# EAGLE design Schematic (EAGLE 9.4.2)
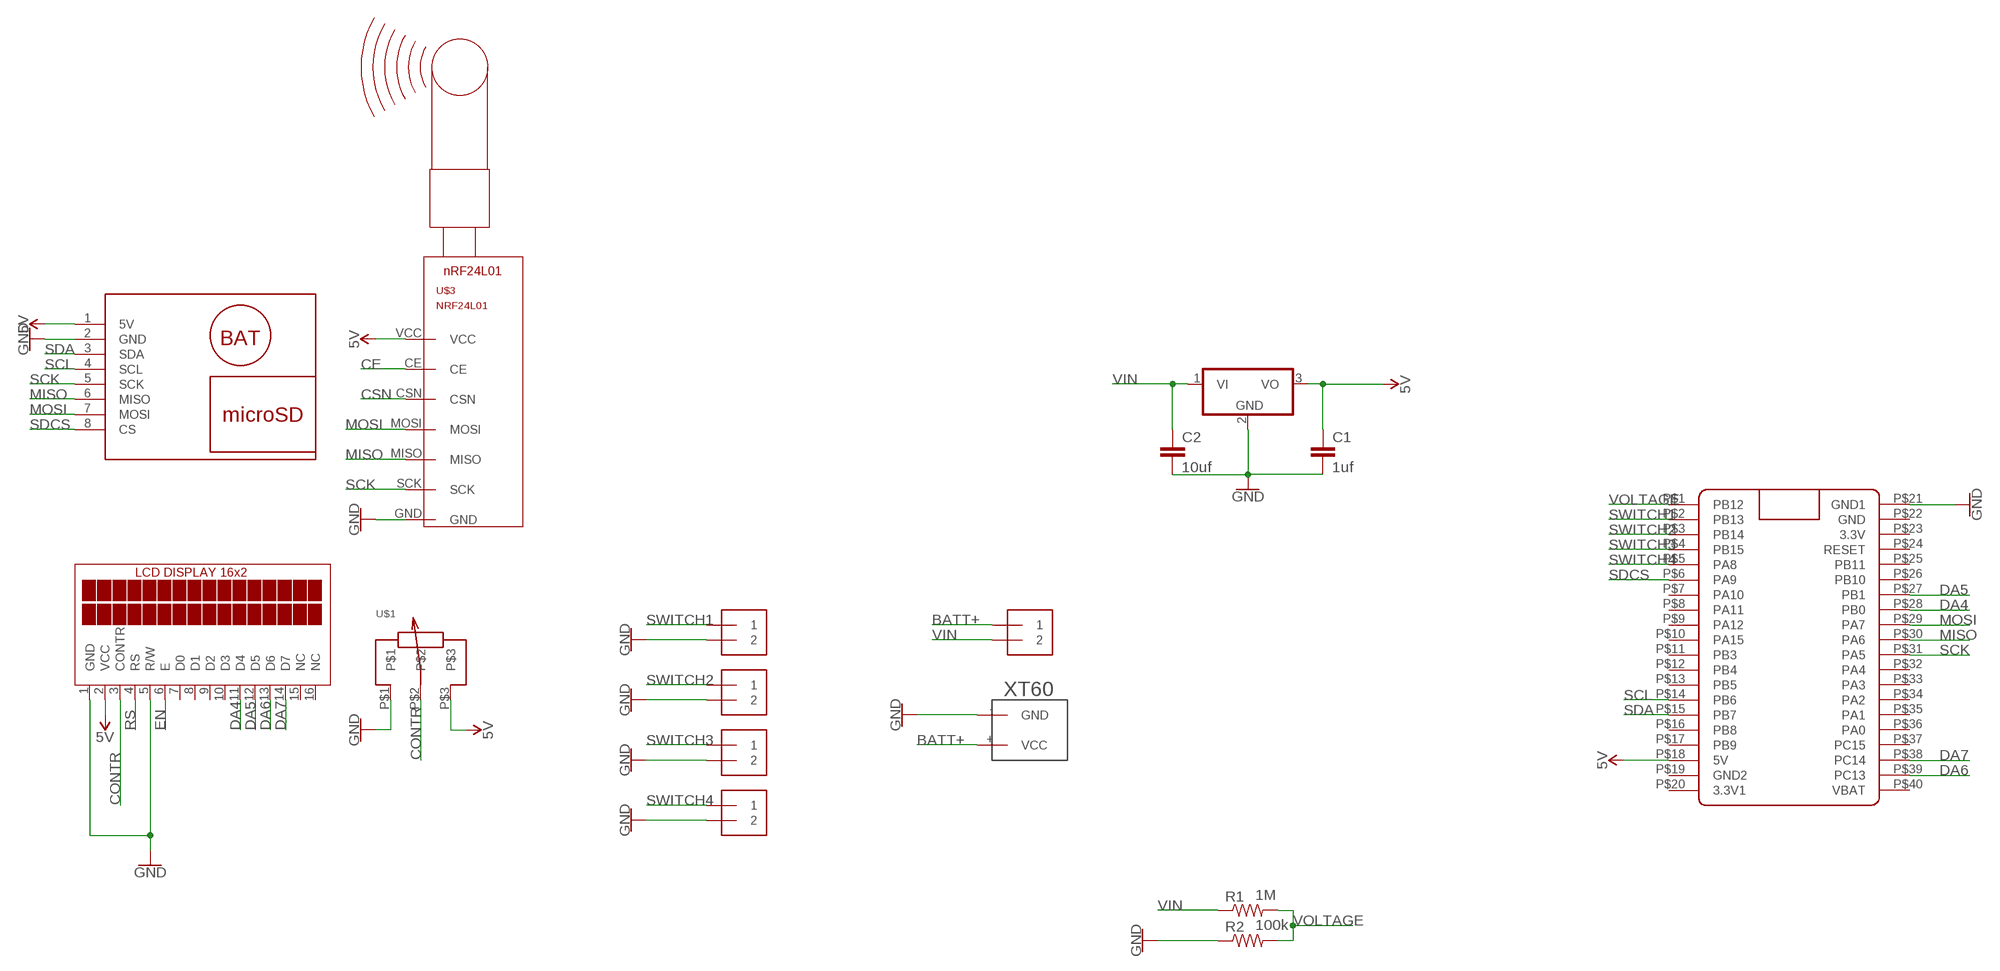
[diagram p0: schematic, sheet 1]

## Parts
C1  1uf  C-EU025-030X050  [C025-030X050]
C2  10uf  C-EU025-030X050  [C025-030X050]
DIS1  TUXGR_16X2_R2  [TUXGR_16X2_R2]
IC1  7805T  [TO220H]
J1  1X2-3.5MM  [1X2-3.5MM]
J2  1X2-3.5MM  [1X2-3.5MM]
J3  1X2-3.5MM  [1X2-3.5MM]
J4  1X2-3.5MM  [1X2-3.5MM]
J5  1X2-3.5MM  [1X2-3.5MM]
R1  1M  R-US_0204/5  [0204/5]
R2  100k  R-US_0204/5  [0204/5]
U$1  POTENTIOMETER  [POTENTIOMETER]
U$2  XT60  [XT60]
U$3  NRF24L01  [NRF24L01]
U$4  DATA-LOGGER-MINI  [DATA-LOGGER-MINI]
U$6  BLUE_PILL  [BLUE_PILL]

## Nets
5V: C1.1 DIS1.2(VCC) IC1.3(VO) U$1.P$3 U$3.VCC U$4.1(5V) U$6.P$18(5V)
BATT+: J5.1 U$2.+(VCC)
CE: U$3.CE
CONTR: DIS1.3(CONTR) U$1.P$2
CSN: U$3.CSN
DA4: DIS1.11(D4) U$6.P$28(PB0)
DA5: DIS1.12(D5) U$6.P$27(PB1)
DA6: DIS1.13(D6) U$6.P$39(PC13)
DA7: DIS1.14(D7) U$6.P$38(PC14)
EN: DIS1.6(E)
GND: C1.2 C2.2 DIS1.1(GND) DIS1.5(R/W) IC1.2(GND) J1.2 J2.2 J3.2 J4.2 R2.1 U$1.P$1 U$2.-(GND) U$3.GND U$4.2(GND) U$6.P$21(GND1)
MISO: U$3.MISO U$4.6(MISO) U$6.P$30(PA6)
MOSI: U$3.MOSI U$4.7(MOSI) U$6.P$29(PA7)
RS: DIS1.4(RS)
SCK: U$3.SCK U$4.5(SCK) U$6.P$31(PA5)
SCL: U$4.4(SCL) U$6.P$14(PB6)
SDA: U$4.3(SDA) U$6.P$15(PB7)
SDCS: U$4.8(CS) U$6.P$6(PA9)
SWITCH1: J1.1 U$6.P$2(PB13)
SWITCH2: J2.1 U$6.P$3(PB14)
SWITCH3: J3.1 U$6.P$4(PB15)
SWITCH4: J4.1 U$6.P$5(PA8)
VIN: C2.1 IC1.1(VI) J5.2 R1.1
VOLTAGE: R1.2 R2.2 U$6.P$1(PB12)
Unconnected: DIS1.7(D0) DIS1.8(D1) DIS1.9(D2) DIS1.10(D3) DIS1.15(NC) DIS1.16(NC) U$6.P$7(PA10) U$6.P$8(PA11) U$6.P$9(PA12) U$6.P$10(PA15) U$6.P$11(PB3) U$6.P$12(PB4) U$6.P$13(PB5) U$6.P$16(PB8) U$6.P$17(PB9) U$6.P$19(GND2) U$6.P$20(3.3V1) U$6.P$22(GND) U$6.P$23(3.3V) U$6.P$24(RESET) U$6.P$25(PB11) U$6.P$26(PB10) U$6.P$32(PA4) U$6.P$33(PA3) U$6.P$34(PA2) U$6.P$35(PA1) U$6.P$36(PA0) U$6.P$37(PC15) U$6.P$40(VBAT)

## Library data of the parts
C1 C2 = NRF24L01+:C-EU: CAPACITOR, European symbol
DIS1 = display-lcd:TUXGR_16X2_R2: Tuxgraphics LCD display 16x2 characters reflective, without background light Source: tuxgr_12x2_r2.pdf; OC_FARNELL: unknown; OC_NEWARK: unknown
IC1 = adafruit:78*: Positive VOLTAGE REGULATOR Added bigger pads to the TO-92 package
J1-J5 = adafruit:1X2: 3.5mm Terminal block http://www.ladyada.net/library/pcb/eaglelibrary.html
R1 R2 = adafruit:R-US_: RESISTOR, American symbol
U$1 = NRF24L01+:POTENTIOMETER
U$2 = XT60:XT60: XT60
U$3 = NRF24L01+:NRF24L01: nrF54L01 2.4GHz with 100 Channels Emitter/Reveiver SPI Controlled Roboshop / Minint
U$4 = MicroSD-Breakout:DATA-LOGGER-MINI: Mini Data Logger with microSD card and battery powered RTC based on DS1307 chip Arduino library for DS1307 and description are available here: https://www.pjrc.com/teensy/td_libs_DS1307RTC.html Tutorial how to use SD card with Arduino: https://www.arduino.cc/en/reference/SD Click here to find device on ebay.com <http://www.ebay.com/sch/mini+data+logger+arduino>
U$6 = BluePill:BLUE_PILL

## Board
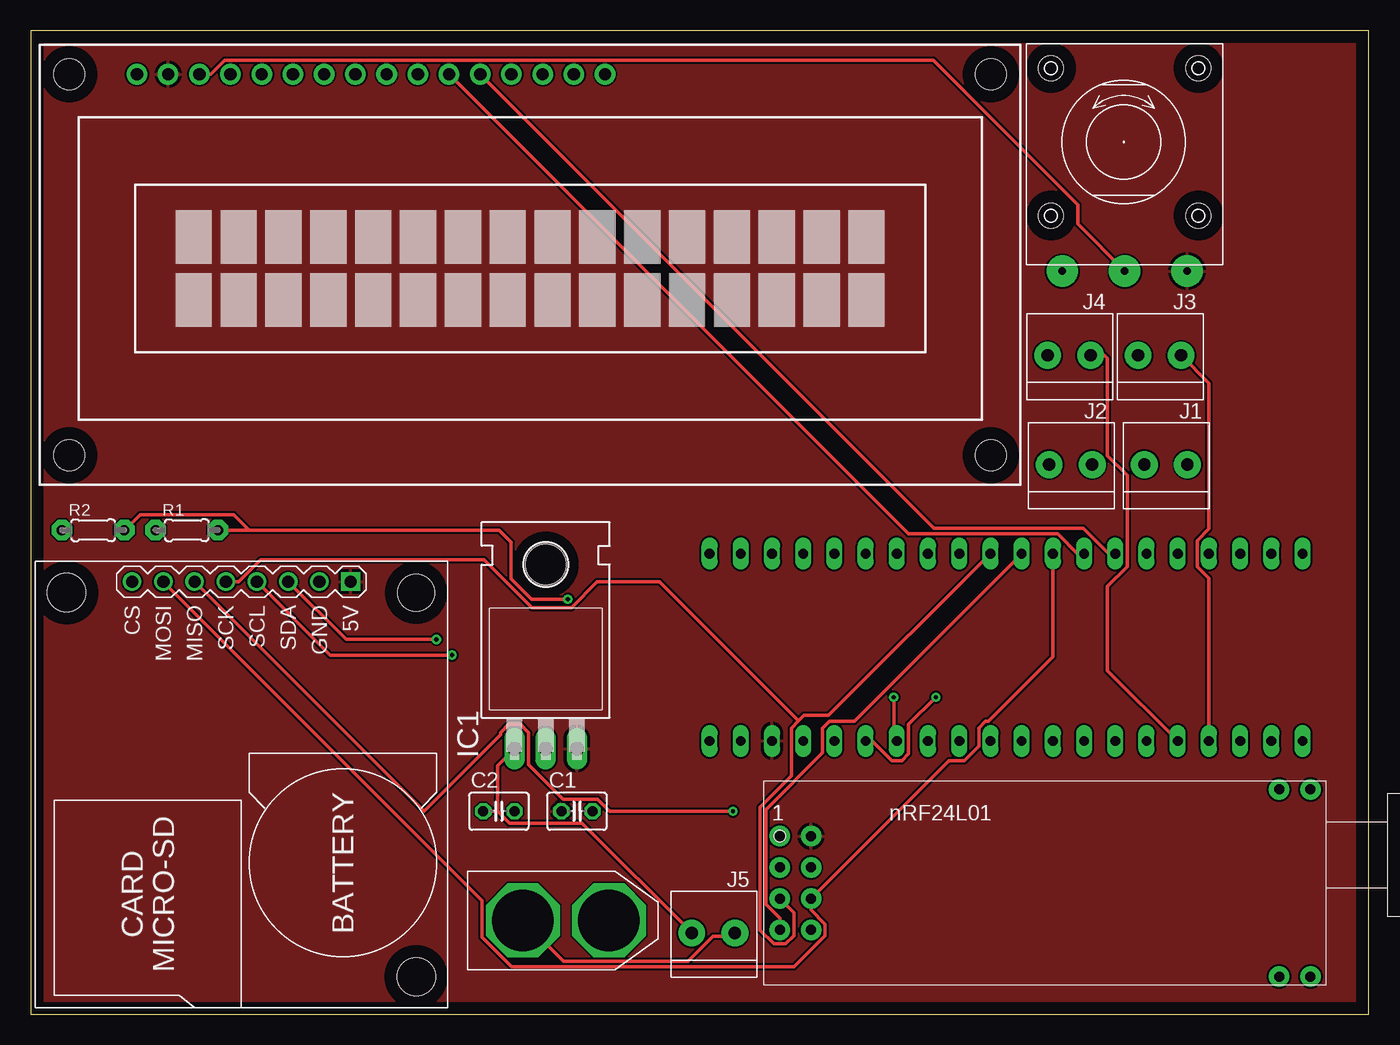
[diagram p1: board, top side]
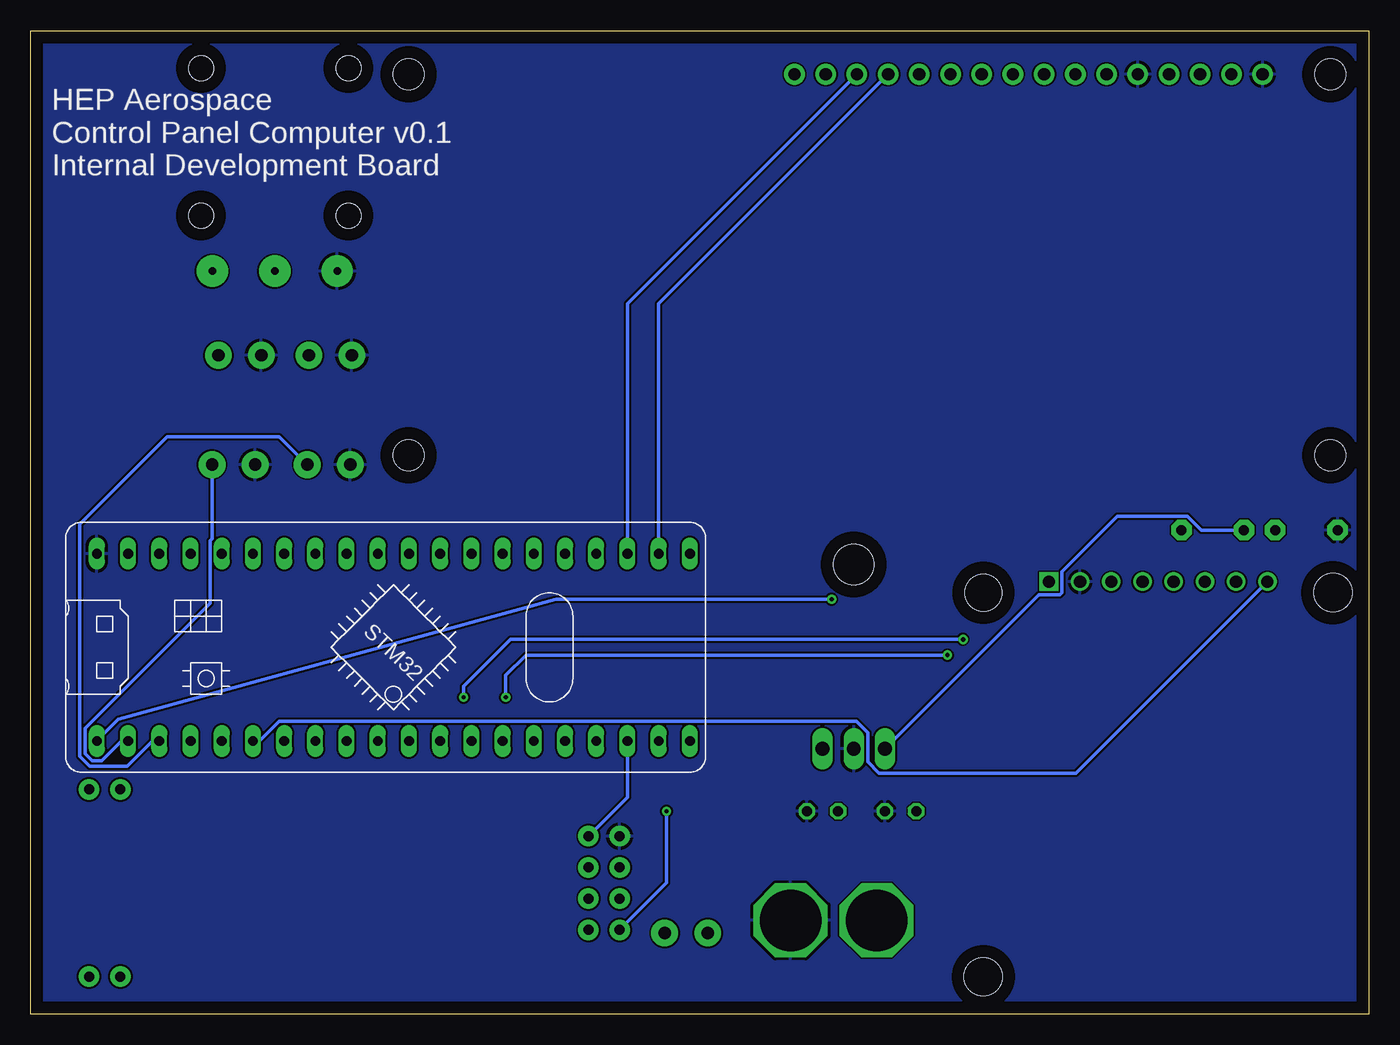
[diagram p2: board, bottom side, seen from below]

Size 108.89 x 80 mm. Coordinates in mm from the lower left corner, seen from the top.
Outline: 0,0 108.89,0 108.89,80 0,80 0,0
Copper layers (1*16): Top 0.035mm / dielectric 1.5mm / Bottom 0.035mm
Design rules "default": minimum track width 6mil, minimum drill 0.35mm, track to track 6mil, track to pad 6mil, pad to pad 6mil, via to via 6mil, smd to smd 6mil, copper to edge 40mil, drill to drill 6mil, minimum pad ring 10mil, minimum via ring 8mil, stop-mask expansion 4mil, vias tented up to drill 0mil, thermal gap 10mil

### Footprints (pad centres in the part's own frame; a part is rotated, then mirrored left to right if it is on the bottom)
C025-030X050 = drill 0.813 octagon: 1 -1.27,0; 2 1.27,0
TUXGR_16X2_R2 = drill 1 pad 1.676: 1 -32,15.5; 2 -29.46,15.5; 3 -26.92,15.5; 4 -24.38,15.5; 5 -21.84,15.5; 6 -19.3,15.5; 7 -16.76,15.5; 8 -14.22,15.5; 9 -11.68,15.5; 10 -9.14,15.5; 11 -6.6,15.5; 12 -4.06,15.5; 13 -1.52,15.5; 14 1.02,15.5; 15 3.56,15.5; 16 6.1,15.5 | hole 2.5: -37.5,-15.5; 37.5,-15.5; -37.5,15.5; 37.5,15.5
TO220H = drill 1.118 long: 1 -2.54,-10.16; 2 0,-10.16; 3 2.54,-10.16 | hole 3.302: 0,4.826
1X2-3.5MM = drill 1 pad 2.184: 1 1.8,0; 2 -1.7,0
0204/5 = drill 0.813 pad 1.676 octagon: 1 -2.54,0; 2 2.54,0
POTENTIOMETER = drill 0.6 pad 2.54: P$1 -5.08,0; P$2 0,0; P$3 5.08,0 | hole 2: -6,16.5; 6,16.5; 6,4.5; -6,4.5
XT60 = drill 5 octagon: + 4.5,0; - 11.5,0
NRF24L01 = drill 0.8 pad 1.676: CE 0,-2.54; CSN 2.54,-2.54; GND 0,0; MISO 0,-7.62; MOSI 2.54,-5.08; P$1 40.64,-11.43; P$2 43.18,-11.43; P$3 43.18,3.81; P$4 40.64,3.81; P$8 2.54,-7.62; SCK 0,-5.08; VCC 2.54,0
DATA-LOGGER-MINI = drill 1 square: 1 -16.51,8.89 | drill 1: 2 -16.51,6.35; 3 -16.51,3.81; 4 -16.51,1.27; 5 -16.51,-1.27; 6 -16.51,-3.81; 7 -16.51,-6.35; 8 -16.51,-8.89 | hole 3: -15.621,14.224 | hole 3.1: -15.621,-14.224; 15.621,14.224
BLUE_PILL = drill 0.8 long: P$1 -7.62,15.24; P$2 -7.62,12.7; P$3 -7.62,10.16; P$4 -7.62,7.62; P$5 -7.62,5.08; P$6 -7.62,2.54; P$7 -7.62,0; P$8 -7.62,-2.54; P$9 -7.62,-5.08; P$10 -7.62,-7.62; P$11 -7.62,-10.16; P$12 -7.62,-12.7; P$13 -7.62,-15.24; P$14 -7.62,-17.78; P$15 -7.62,-20.32; P$16 -7.62,-22.86; P$17 -7.62,-25.4; P$18 -7.62,-27.94; P$19 -7.62,-30.48; P$20 -7.62,-33.02; P$21 7.62,15.24; P$22 7.62,12.7; P$23 7.62,10.16; P$24 7.62,7.62; P$25 7.62,5.08; P$26 7.62,2.54; P$27 7.62,0; P$28 7.62,-2.54; P$29 7.62,-5.08; P$30 7.62,-7.62; P$31 7.62,-10.16; P$32 7.62,-12.7; P$33 7.62,-15.24; P$34 7.62,-17.78; P$35 7.62,-20.32; P$36 7.62,-22.86; P$37 7.62,-25.4; P$38 7.62,-27.94; P$39 7.62,-30.48; P$40 7.62,-33.02

### Placement (x,y rotation side)
C1  44.45,16.51 0 top
C2  38.1,16.51 0 top
DIS1  40.64,60.96 0 top
IC1  41.91,31.75 0 top
J1  92.33,44.7 0 top
J2  84.58,44.7 0 top
J3  91.82,53.59 0 top
J4  84.45,53.59 0 top
J5  55.5,6.6 0 top
R1  12.7,39.37 0 top
R2  5.08,39.37 0 top
U$1  89.03,60.45 0 top
U$2  35.56,7.62 0 top
U$3  60.96,14.48 0 top
U$4  17.14,18.67 270 top
U$6  88.27,29.84 90 bottom

### Tracks (layer width: path | path; a pad name or v marks a point on that pad's centre or on a via)
5V
  Bottom 0.305: U$6.P$18 60.33,17.65 U$3.VCC
  pour Top: -16.51,-8.89 -16.51,68.58 1.27,86.36 106.68,86.36 123.19,69.85 137.16,55.88 137.16,-11.43 -13.97,-11.43
BATT+
  Top 0.305: U$2.+ 43.37,4.31 53.48,4.31 55.52,6.35 57.15,6.35 57.15,6.46 J5.1
CONTR
  Top 0.305: U$1.P$2 85.19,64.28 85.19,65.85 73.44,77.6 15.79,77.6 14.64,76.46 DIS1.3
DA4
  Top 0.305: DIS1.11 71.42,39.08 83.58,39.08 85.19,37.47 U$6.P$28
DA5
  Top 0.305: DIS1.12 73.5,39.53 85.67,39.53 87.73,37.47 U$6.P$27
DA6
  Bottom 0.305: DIS1.13 57.78,57.8 U$6.P$39
DA7
  Bottom 0.305: DIS1.14 60.33,57.8 U$6.P$38
GND
  pour Bottom: -21.59,-8.89 -21.59,71.12 -1.27,91.44 1.27,93.98 115.57,93.98 124.46,85.09 124.46,66.04 124.46,-13.97 110.49,-27.94 -2.54,-27.94
MISO  (via drill 0.35)
  Top 0.305: U$3.MISO 60.96,7.78 59.82,8.93 59.82,16.64 64.45,21.27 64.45,23.28 65.01,23.84 67.02,23.84 U$6.P$30 | U$4.6 32,16.51 38.23,22.73 38.23,22.9 38.9,23.57 39.84,23.57 40.51,22.9 40.51,20.28 43.32,17.48 46.12,17.48 47.09,16.51 v57.15,16.51
  Bottom 0.305: v57.15,16.51 57.15,10.67 U$3.MISO
MOSI
  Top 0.305: U$6.P$29 83.19,29.08 77.94,23.84 77.71,23.84 77.15,23.28 77.15,21.8 75.96,20.61 74.71,20.61 U$3.MOSI 63.5,8.47 64.64,7.33 64.64,6.38 62.11,3.85 39.15,3.85 36.75,6.25 36.75,9.23 U$4.7
SCK
  Top 0.305: U$6.P$31 64.94,24.3 62.92,24.3 62.49,23.86 | 62.49,23.86 61.91,23.28 61.91,19.37 59.36,16.83 59.36,6.84 60.49,5.71 61.43,5.71 62.1,6.38 62.1,8.26 U$3.SCK | 62.49,23.86 51.18,35.18 46.1,35.18 44,33.07 40.78,33.07 36.89,36.96 18.7,36.96 16.92,35.18 U$4.5
SCL  (via drill 0.35)
  Top 0.305: U$4.4 24.38,29.21 v34.29,29.21 | v70.23,25.78 70.23,22.48 U$6.P$14
  Bottom 0.305: v34.29,29.21 68.58,29.21 70.23,27.56 v70.23,25.78
SDA  (via drill 0.35)
  Top 0.305: U$4.3 25.65,30.48 v33.02,30.48 | v73.66,25.78 71.44,23.57 71.44,21.17 70.88,20.61 70.09,20.61 68.47,22.23 U$6.P$15
  Bottom 0.305: v33.02,30.48 69.85,30.48 73.66,26.67 v73.66,25.78
SDCS
  Bottom 0.305: U$6.P$6 90.28,22.23 88.66,23.84 41.7,23.84 40.77,22.9 40.77,20.53 39.84,19.61 23.82,19.61 U$4.8
SWITCH1
  Bottom 0.305: J1.1 94.13,38.69 94.3,38.52 94.3,33.44 104.46,23.28 104.46,21.17 103.9,20.61 103.11,20.61 101.5,22.23 U$6.P$2
SWITCH2
  Bottom 0.305: U$6.P$3 98.95,22.23 101.03,20.16 104.09,20.16 104.92,20.98 104.92,39.86 97.79,46.99 88.67,46.99 J2.1
SWITCH3
  Top 0.305: J3.1 95.89,51.33 95.89,39.48 94.93,38.52 94.93,36.41 95.89,35.45 U$6.P$4
SWITCH4
  Top 0.305: U$6.P$5 87.63,27.94 87.63,34.82 89.22,36.41 89.22,43.84 87.63,45.43 87.63,53.34 87.38,53.59 J4.1
VIN
  Top 0.305: J5.2 44.86,15.54 38.97,15.54 38.01,16.51 | 38.01,16.51 C2.1 | IC1.1 38.01,20.23 38.01,16.51
  Bottom 0.305: IC1.1 26.84,34.12 25.16,34.12 24.98,34.3 24.98,35.98 20.45,40.51 14.77,40.51 13.62,39.37 R1.1
VOLTAGE  (via drill 0.35)
  Top 0.305: R1.2 17.78,39.37 | 17.78,39.37 38.1,39.37 39.09,38.38 39.09,35.41 40.74,33.76 v43.71,33.76 | R2.2 8.89,40.64 16.51,40.64 17.78,39.37
  Bottom 0.305: U$6.P$1 101.75,23.98 66.12,33.76 v43.71,33.76

### Text on the board
bPlace: HEP Aerospace / Control Panel Computer v0.1 / Internal Development Board